# Altium schematic sheet 5V_Power_Supply.SchDoc: STM32F446 CNC
size B; Author: AM; CompanyName: Expatria Technologies; DrawnBy: A.Marles; Engineer: AM; Organization: Expatria Technolgoies; DocumentNumber: 9; SheetNumber: 9; SheetTotal: 14
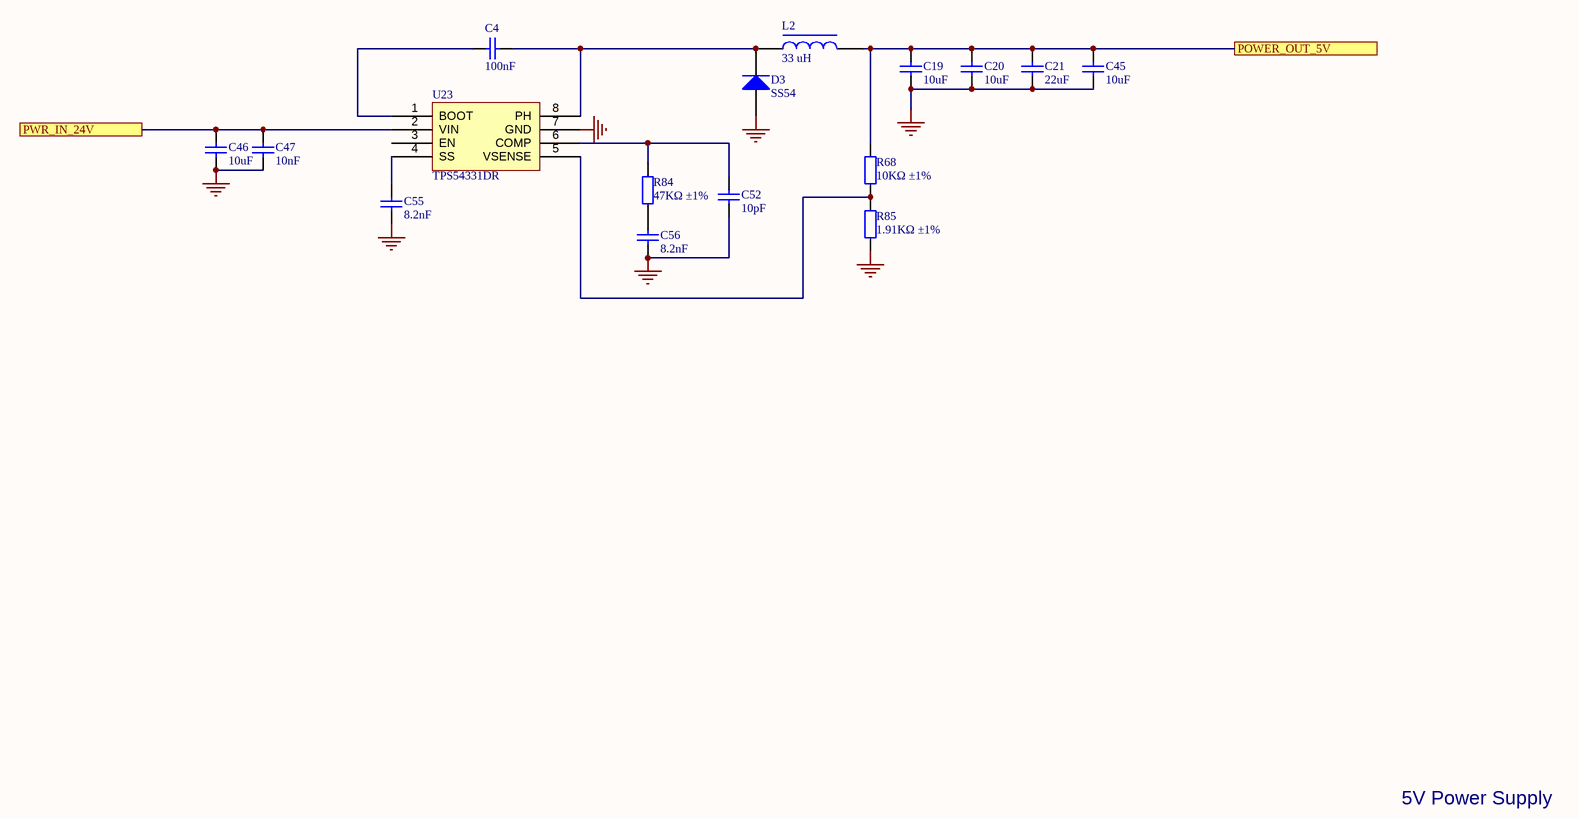
[diagram p0: 5V_Power_Supply.SchDoc]

## Parts
C4  100nF  [0603_C]
C19  10uF  [1206_C]
C20  10uF  [1206_C]
C21  22uF  [0805_C]
C45  10uF  [1206_C]
C46  10uF  [1206_C]
C47  10nF  [0603_C]
C52  10pF  [0603_C]
C55  8.2nF  [0603_C]
C56  8.2nF  [0603_C]
D3  SS54  [SMA(DO-214AC)_S1]
L2  33 uH  [INDPM7366X300N]
R68  10KΩ ±1%  [0603_R]
R84  47KΩ ±1%  [0603_R]
R85  1.91KΩ ±1%  [0603_R]
U23  TPS54331DR  [SOIC-8_150mil]

## Ports
POWER_OUT_5V, PWR_IN_24V

## Nets
GND: C19.1 C20.1 C21.1 C45.1 C46.1 C47.1 C52.1 C55.1 C56.1 D3.1(A) R85.1 U23.7(GND)
POWER_OUT_5V: C19.2 C20.2 C21.2 C45.2 L2.2 R68.2 ; port POWER_OUT_5V
PWR_IN_24V: C46.2 C47.2 U23.2(VIN) ; port PWR_IN_24V
NetC4_1: C4.1 U23.1(BOOT)
NetC4_2: C4.2 D3.2(K) L2.1 U23.8(PH)
NetC52_2: C52.2 R84.2 U23.6(COMP)
NetC55_2: C55.2 U23.4(SS)
NetC56_2: C56.2 R84.1
NetR68_1: R68.1 R85.2 U23.5(VSENSE)

Not connected (* = marked no-connect by the designer): U23 3(EN)

## Notes on the sheet
- 5V Power Supply
- SHEET
- Expatria Technologies
- 1136 Glade Court
- Port Coquitlam, BC V3B 1R5
- PROJECT
- SIZE
- ENGR
- MODIFIED
- DOCUMENT
- REV
- Copyright Expatria Technologies 2022. This document describes Open Hardware and is licensed under the CERN-OHL-S v2. No warranty is implied or expressed.
- EMAIL: INFO@EXPATRIA.CA
- B
- /

## Library data of the parts
C4 = 0603 100nF (104) 10% 50V: Chip capacitors; Manufacturer: YAGEO; PartNumber: CC0603KRX7R9BB104; Tolerance: 10%; Voltage: 50V; Package: 0603; Supplier: LC; SuppliersPartNumber: C14663; Capacitance: 100nF; Manufacturer 1: YAGEO
C19 C20 C45 C46 = 1206 10uF (106) 10% 50V: Chip capacitors; Manufacturer: Samsung Electro-Mechanics; PartNumber: CL31A106KBHNNNE; Tolerance: 10%; Voltage: 50V; Package: 1206; Supplier: LC; SuppliersPartNumber: C13585; Capacitance: 10uF
  C19 C20 C45: ComponentLink1Description: Supplier link; ComponentLink1URL: http://www.szlcsc.com/product/details_14236.html
  C46: Manufacturer 1: Samsung Electro-Mechanics
C21 = 0805 22uF (226) 20% 25V: Chip capacitors; Manufacturer: Samsung Electro-Mechanics; PartNumber: CL21A226MAQNNNE; Tolerance: 20%; Voltage: 25V; Package: 0805; Supplier: LC; SuppliersPartNumber: C2922481; Capacitance: 22uF; ComponentLink1Description: Supplier link; ComponentLink1URL: http://www.szlcsc.com/product/details_46786.html
C47 = 0603 10nF (103) 10% 50V: Chip capacitors; Manufacturer: Guangdong Fenghua Advanced Tech; PartNumber: 0603B103K500NT; Tolerance: 10%; Voltage: 50V; Package: 0603; Supplier: LC; SuppliersPartNumber: C57112; Capacitance: 10nF; ComponentLink1Description: Supplier link; ComponentLink1URL: http://www.szlcsc.com/product/details_58143.html
C52 = 0603 10pF (100) 5% 50V: Chip capacitors; Manufacturer: Samsung Electro-Mechanics; PartNumber: CL10C100JB8NNNC; Tolerance: 5%; Voltage: 50V; Package: 0603; Supplier: LC; SuppliersPartNumber: C1634; Capacitance: 10pF; ComponentLink1Description: Supplier link; ComponentLink1URL: http://www.szlcsc.com/product/details_1986.html
C55 C56 = 0603 8.2nF (822) 10% 50V: Chip capacitors; Manufacturer: Samsung Electro-Mechanics; PartNumber: CL10B822KB8NNNC; Tolerance: 10%; Voltage: 50V; Package: 0603; Supplier: LC; SuppliersPartNumber: C27920; Capacitance: 8.2nF
  C55: Manufacturer 1: Samsung Electro-Mechanics
  C56: ComponentLink1Description: Supplier link; ComponentLink1URL: http://www.szlcsc.com/product/details_28670.html
D3 = SMA(DO-214AC) SS54: 40V 5A 550mV@5A; Manufacturer 1: MDD; Package: SMA(DO-214AC); Supplier: LC; SuppliersPartNumber: C22452; Manufacturer Part Number 1: SS54
L2 = 1206 10uH 10%: 33uH ±20% 2A 270mΩ SMD,6.6x7.3x3.0mm Power Inductors RoHS; Package: SMD_6.6x7.3x3.0mm; Supplier: JLCPCB; SuppliersPartNumber: C329385
R68 = 0603 10K (1002) 1%: Chip resistor; Manufacturer: Uniroyal Elec; PartNumber: 0603WAF1002T5E; Power: 1/10W; Package: 0603; Supplier: LC; SuppliersPartNumber: C25804; Resistance: 10KΩ; Tolerance: 1%; ComponentLink1Description: Supplier link; ComponentLink1URL: http://www.szlcsc.com/product/details_26547.html
R84 = 0603 47K (4702) 1%: Chip resistor; Manufacturer: Uniroyal Elec; PartNumber: 0603WAF4702T5E; Power: 1/10W; Package: 0603; Supplier: LC; SuppliersPartNumber: C25819; Resistance: 47KΩ; Tolerance: 1%; ComponentLink1Description: Supplier link; ComponentLink1URL: http://www.szlcsc.com/product/details_26562.html
R85 = 0603 2K (2001) 1%: Chip resistor; Manufacturer: Uniroyal Elec; PartNumber: 0603WAF1911T5E; Power: 1/10W; Package: 0603; Supplier: LC; SuppliersPartNumber: C22853; Resistance: 1.91KΩ; Tolerance: 1%; ComponentLink1Description: Supplier link; ComponentLink1URL: http://www.szlcsc.com/product/details_23702.html
U23 = TPS54331DR_[C9865]: Switching Voltage Regulators 3A 28V In Step Down SWIFT DC/DC Cnvrtr; Package: SOIC-8_150mil; Supplier: LC; SuppliersPartNumber: C9865